# EAGLE board Mega 2560 Z21 (EAGLE 9.6.0)
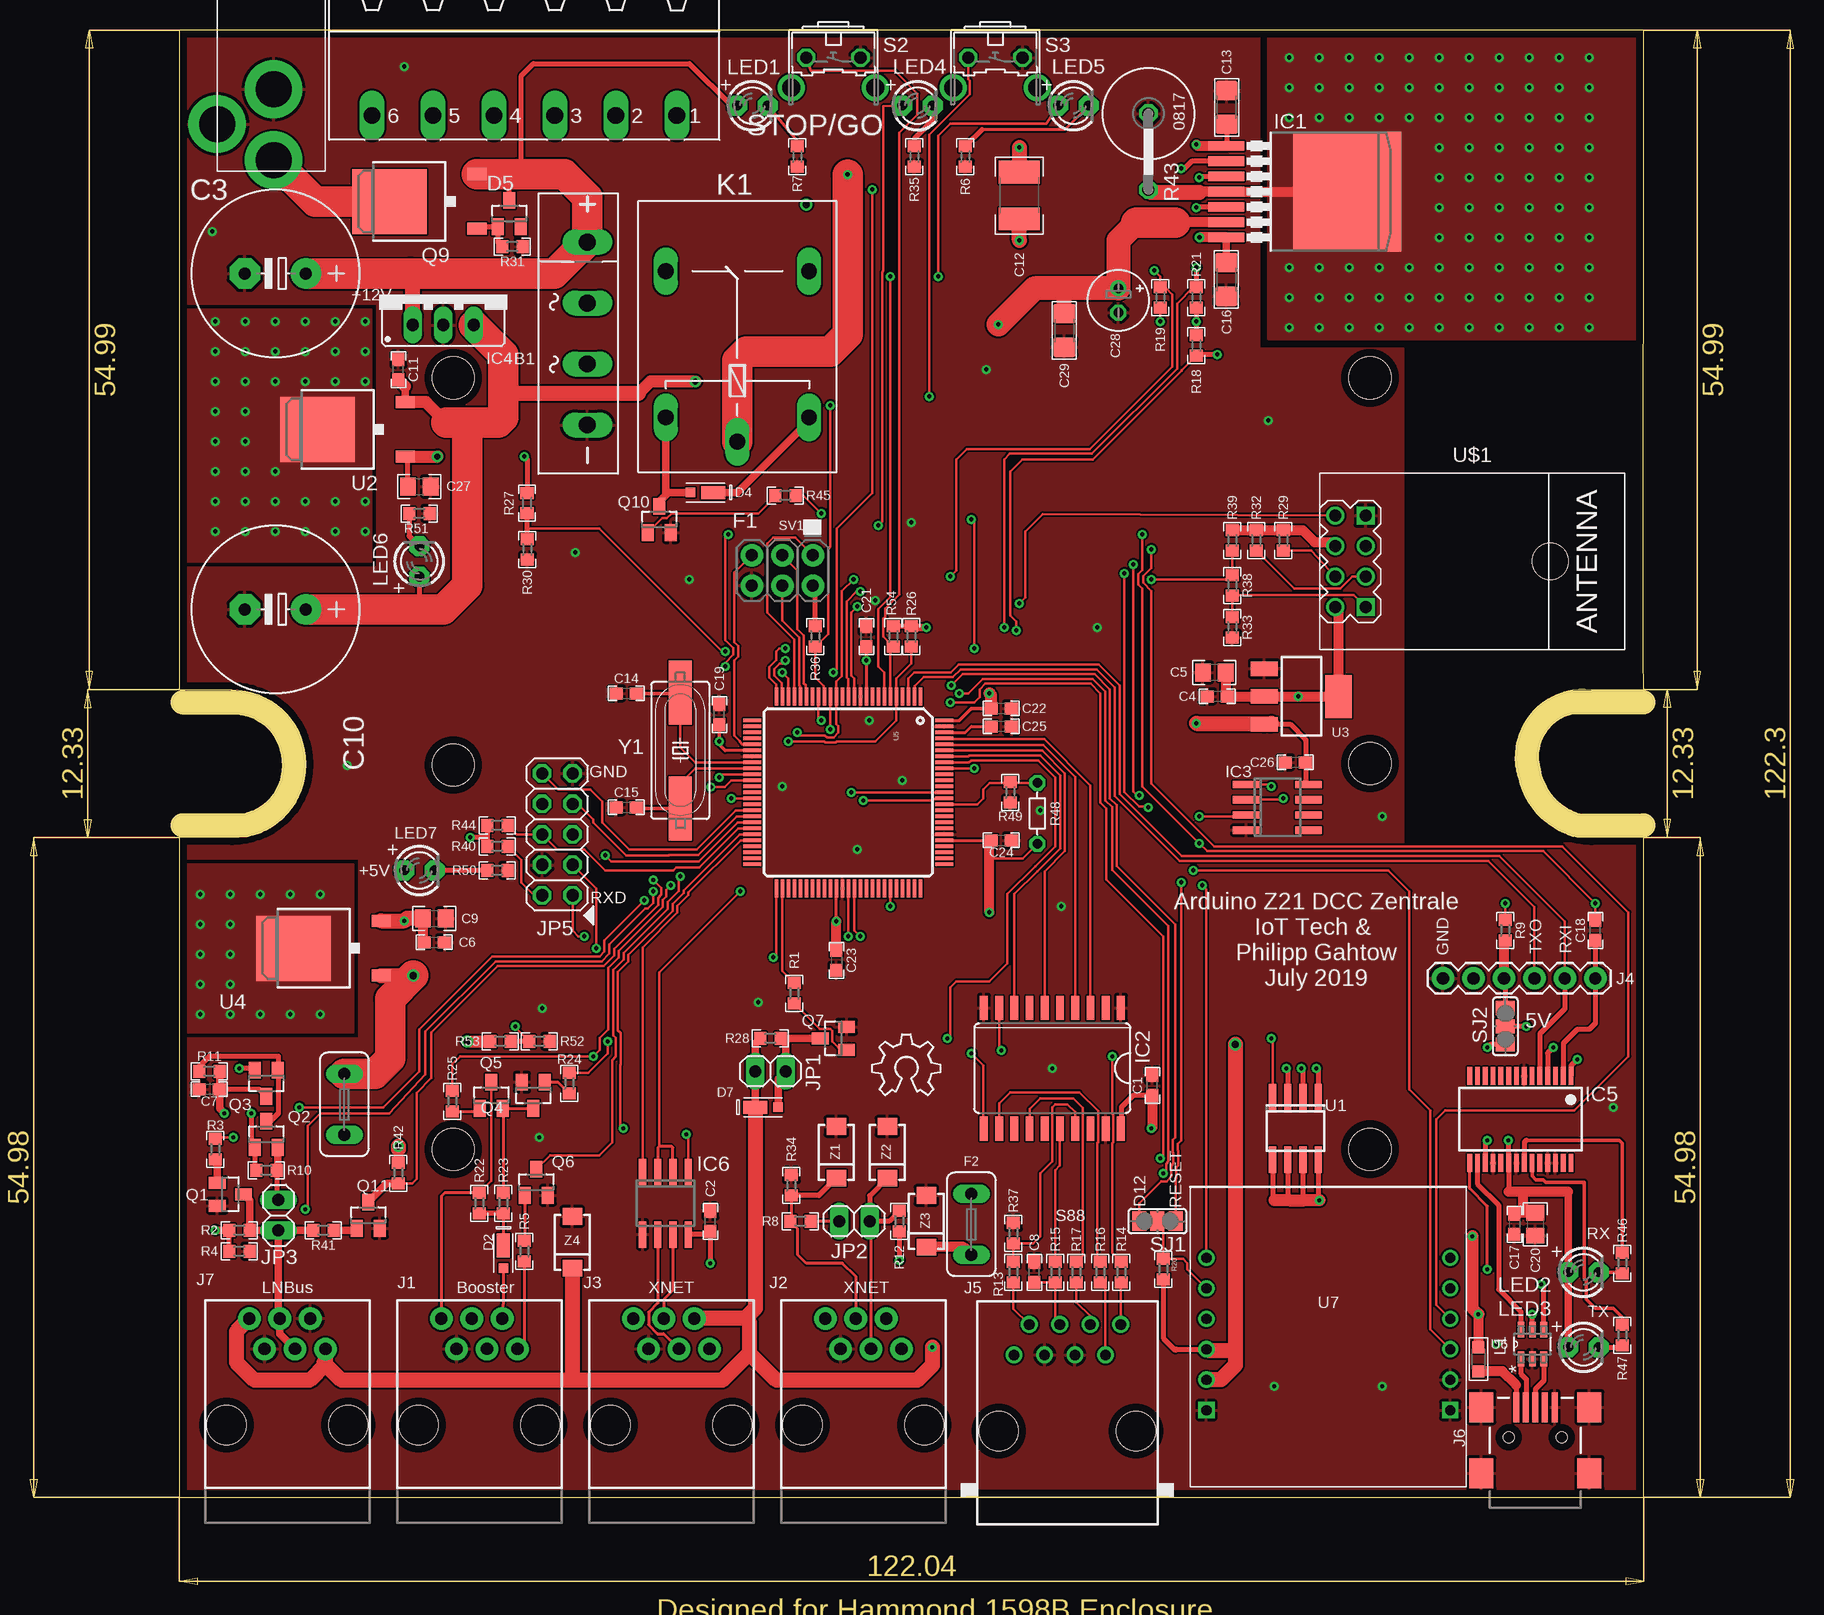
[diagram p1: board, top side]
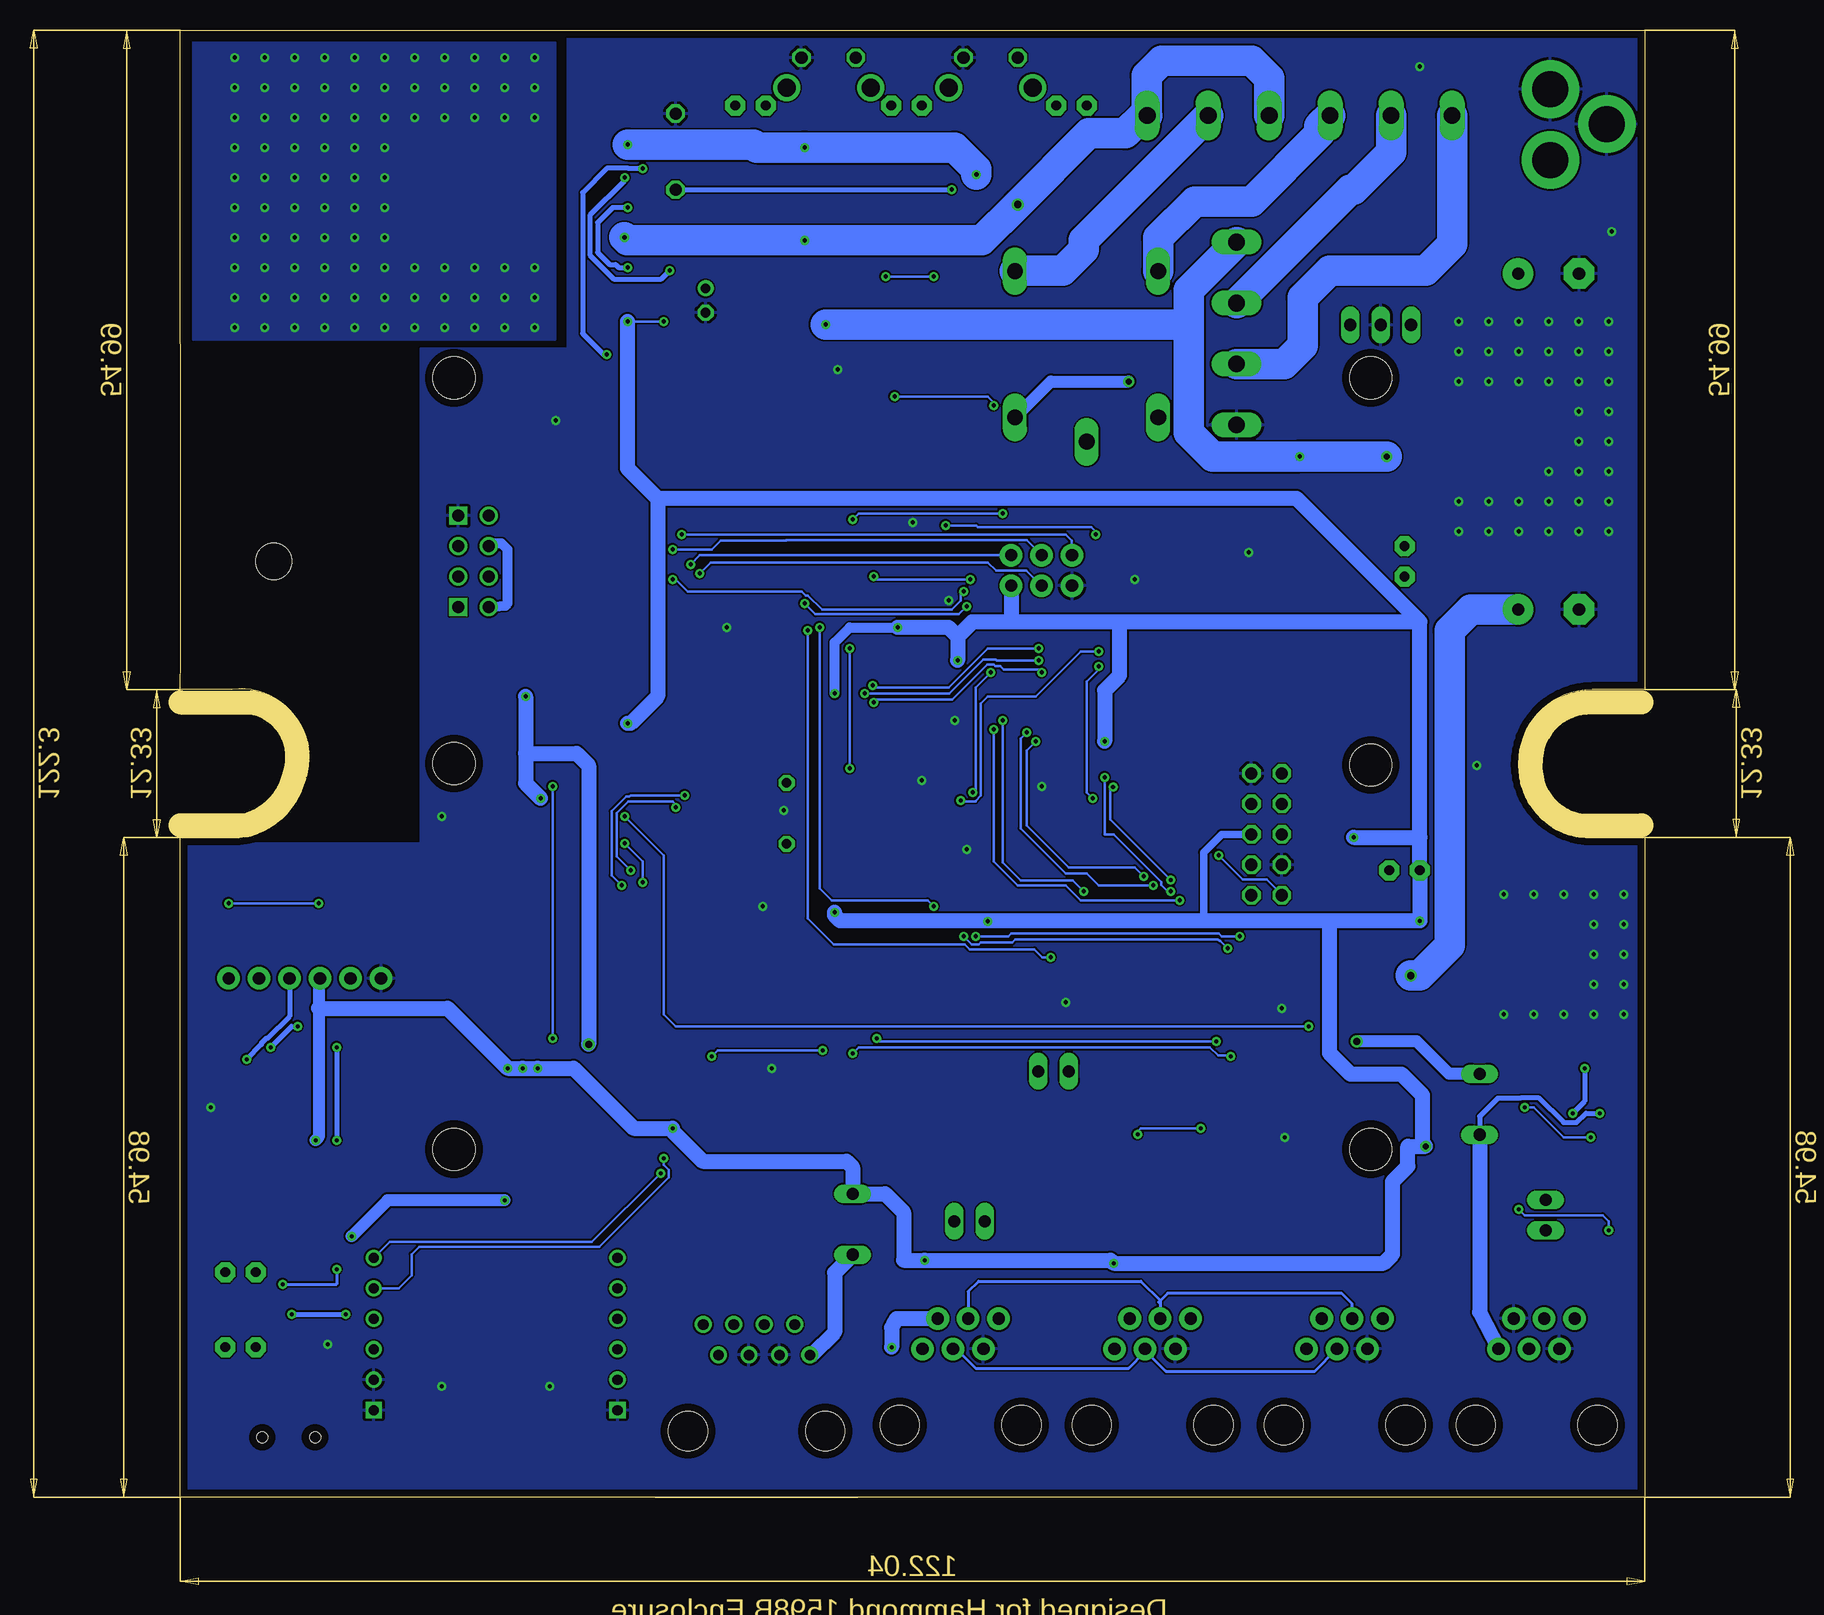
[diagram p2: board, bottom side, seen from below]

Size 122.04 x 122.3 mm. Coordinates in mm from the lower left corner, seen from the top.
Outline: 0,0 122.04,0 122.04,54.98 117.69,54.98 arc-90 111.51,61.15 arc-106 117.69,67.31 122.04,67.31 122,70 122.04,122.3 0,122.3 0,67.31 4.38,67.31 arc-90 10.53,61.15 10.53,61.02 arc-90 4.38,54.98 0,54.98 0,0
Copper layers (1*16): Top 0.035mm / dielectric 1.5mm / Bottom 0.035mm
Design rules "default": minimum track width 6mil, minimum drill 0.35mm, track to track 6mil, track to pad 6mil, pad to pad 6mil, via to via 6mil, smd to smd 6mil, copper to edge 25mil, drill to drill 6mil, minimum pad ring 10mil, minimum via ring 8mil, stop-mask expansion 4mil, vias tented up to drill 0mil, thermal gap 10mil
Net classes: 1 pwr: width 0.2 mm, drill 0.3 mm, clearance 0.205 mm to class 0, clearance 0.205 mm; 2 gnd: width 0.2 mm, drill 0.3 mm, clearance 0.205 mm to class 0, clearance 0.205 mm to class 1, clearance 0.205 mm
Holes 3.5 mm at 22.82,29 22.82,61.02 22.82,93.3 99.22,29 99.22,61.15 99.22,93.3
Holes 3 mm at 114.25,78
Milling: 8 lines

## Footprints (pad centres in the part's own frame; a part is rotated, then mirrored left to right if it is on the bottom)
KBU-6D = drill 1.397 long: + -7.62,0; - 7.62,0; AC1 -2.54,0; AC2 2.54,0
C0603 = smd 1.1 x 1: 1 -0.85,0; 2 0.85,0
E5-13 = drill 1.016 pad 2.54: + -2.54,0 | drill 1.016 pad 2.54 octagon: - 2.54,0
C0805 = smd 1.3 x 1.5: 1 -0.95,0; 2 0.95,0
C1812 = smd 1.9 x 3.4: 1 -1.95,0; 2 1.95,0
C1206 = smd 1.6 x 1.8: 1 -1.4,0; 2 1.4,0
E2-5 = drill 0.813 pad 1.27: + -1.016,0 | drill 0.813 pad 1.27 octagon: - 1.016,0
MICROSMP = smd 0.8 x 0.8: A 0.65,0 | smd 2 x 1.1: C -1.25,0
SOT23 = smd 1 x 1.4: 1 -0.95,-1.1; 2 0.95,-1.1; 3 0,1.1
TE5 = drill 1.016 long: 1 -2.54,0; 2 2.54,0
P-TO263-7-1 = smd 0.8 x 3: 1 -3.81,-9.207; 2 -2.54,-9.207; 3 -1.27,-9.207; 4 0,-9.207; 5 1.27,-9.207; 6 2.54,-9.207; 7 3.81,-9.207 | smd 10 x 9: 8 0,0.895
SO20W = smd 0.66 x 2.032: 1 -5.715,-5.029; 2 -4.445,-5.029; 3 -3.175,-5.029; 4 -1.905,-5.029; 5 -0.635,-5.029; 6 0.635,-5.029; 7 1.905,-5.029; 8 3.175,-5.029; 9 4.445,-5.029; 10 5.715,-5.029; 11 5.715,5.029; 12 4.445,5.029; 13 3.175,5.029; 14 1.905,5.029; 15 0.635,5.029; 16 -0.635,5.029; 17 -1.905,5.029; 18 -3.175,5.029; 19 -4.445,5.029; 20 -5.715,5.029
SO08 = smd 0.6 x 2.2: 1 -1.905,-2.6; 2 -0.635,-2.6; 3 0.635,-2.6; 4 1.905,-2.6; 5 1.905,2.6; 6 0.635,2.6; 7 -0.635,2.6; 8 -1.905,2.6
78XXS = drill 1.016 long: GND 0,-2.54; IN -2.54,-2.54; OUT 2.54,-2.54
SSOP28 = smd 0.4 x 1.5: 1 -4.225,-3.625; 2 -3.575,-3.625; 3 -2.925,-3.625; 4 -2.275,-3.625; 5 -1.625,-3.625; 6 -0.975,-3.625; 7 -0.325,-3.625; 8 0.325,-3.625; 9 0.975,-3.625; 10 1.625,-3.625; 11 2.275,-3.625; 12 2.925,-3.625; 13 3.575,-3.625; 14 4.225,-3.625; 15 4.225,3.625; 16 3.575,3.625; 17 2.925,3.625; 18 2.275,3.625; 19 1.625,3.625; 20 0.975,3.625; 21 0.325,3.625; 22 -0.325,3.625; 23 -0.975,3.625; 24 -1.625,3.625; 25 -2.275,3.625; 26 -2.925,3.625; 27 -3.575,3.625; 28 -4.225,3.625
SOIC8 = smd 0.6 x 2.2: 1 -1.905,-2.6; 2 -0.635,-2.6; 3 0.635,-2.6; 4 1.905,-2.6; 5 1.905,2.6; 6 0.635,2.6; 7 -0.635,2.6; 8 -1.905,2.6
RJ11-6 = drill 1.016 pad 1.88: 1 -3.175,8.89; 2 -1.905,6.35; 3 -0.635,8.89; 4 0.635,6.35; 5 1.905,8.89; 6 3.175,6.35 | hole 3.251: -5.08,0; 5.08,0
1X06 = drill 1.016 pad 1.88: 1 0,0; 2 2.54,0; 3 5.08,0; 4 7.62,0; 5 10.16,0; 6 12.7,0
RJ45-NO-SHIELD = drill 0.9 pad 1.4: 1 -4.445,6.35; 2 -3.175,8.89; 3 -1.905,6.35; 4 -0.635,8.89; 5 0.635,6.35; 6 1.905,8.89; 7 3.175,6.35; 8 4.445,8.89 | hole 3.251: -5.715,0; 5.715,0
USB-MINIB = smd 2.5 x 0.5: D+ 2.5,0; D- 2.5,0.8; GND 2.5,-1.6; ID 2.5,-0.8; VBUS 2.5,1.6 | smd 2.5 x 2: S1 -3,4.5; S2 2.5,4.5; S3 -3,-4.5; S4 2.5,-4.5 | hole 0.9: 0,2.2; 0,-2.2
1X02 = drill 1.016 long: 1 -1.27,0; 2 1.27,0
2X05 = drill 1.016 octagon: 1 -5.08,-1.27; 2 -5.08,1.27; 3 -2.54,-1.27; 4 -2.54,1.27; 5 0,-1.27; 6 0,1.27; 7 2.54,-1.27; 8 2.54,1.27; 9 5.08,-1.27; 10 5.08,1.27
G5LE = drill 1.321 long: 1 -7.493,-5.969; 2 -7.493,5.969; O 4.699,5.969; P -9.525,0; S 4.699,-5.969
L2012C = smd 1 x 1: 1 -1,0; 2 1,0
LED3MM = drill 0.813 pad 1.676 octagon: A -1.27,0; K 1.27,0
TO252 = smd 1 x 1.6: 1 -2.28,-4.8; 2 2.28,-4.8 | smd 5.4 x 6.2: 3 0,2.5
R0603 = smd 1 x 1.1: 1 -0.85,0; 2 0.85,0
P0817V = drill 1.016 octagon: 1 -5.08,0; 2 1.27,0
R-5 = drill 0.813 octagon: 1 -2.54,0; 2 2.54,0
B3F-31XX = drill 1.016 octagon: 1 -2.261,-1.245; 2 2.261,-1.245 | drill 1.499 pad 2.159: 3 -3.505,1.245; 4 3.505,1.245
SJ_2 = smd 1.168 x 1.6: 1 -1.524,0; 2 0,0; 3 1.524,0
2X3-NS = drill 1.016 pad 1.88: 1 -2.54,-1.27; 2 -2.54,1.27; 3 0,-1.27; 4 0,1.27; 5 2.54,-1.27; 6 2.54,1.27
DPAK2 = smd 1 x 1.6: 1 -2.28,-6.07; 3 2.28,-6.07 | smd 5.4 x 6.2: 4 0,1.23
SOT223 = smd 1.219 x 2.235: 1 -2.311,-3.099; 2 0,-3.099; 3 2.311,-3.099 | smd 3.6 x 2.2: 4 0,3.099
TQFP100 = smd 1.5 x 0.3: 1 -8,6; 2 -8,5.5; 3 -8,5; 4 -8,4.5; 5 -8,4; 6 -8,3.5; 7 -8,3; 8 -8,2.5; 9 -8,2; 10 -8,1.5; 11 -8,1; 12 -8,0.5; 13 -8,0; 14 -8,-0.5; 15 -8,-1; 16 -8,-1.5; 17 -8,-2; 18 -8,-2.5; 19 -8,-3; 20 -8,-3.5; 21 -8,-4; 22 -8,-4.5; 23 -8,-5; 24 -8,-5.5; 25 -8,-6; 51 8,-6; 52 8,-5.5; 53 8,-5; 54 8,-4.5; 55 8,-4; 56 8,-3.5; 57 8,-3; 58 8,-2.5; 59 8,-2; 60 8,-1.5; 61 8,-1; 62 8,-0.5; 63 8,0; 64 8,0.5; 65 8,1; 66 8,1.5; 67 8,2; 68 8,2.5; 69 8,3; 70 8,3.5; 71 8,4; 72 8,4.5; 73 8,5; 74 8,5.5; 75 8,6 | smd 0.3 x 1.5: 26 -6,-8; 27 -5.5,-8; 28 -5,-8; 29 -4.5,-8; 30 -4,-8; 31 -3.5,-8; 32 -3,-8; 33 -2.5,-8; 34 -2,-8; 35 -1.5,-8; 36 -1,-8; 37 -0.5,-8; 38 0,-8; 39 0.5,-8; 40 1,-8; 41 1.5,-8; 42 2,-8; 43 2.5,-8; 44 3,-8; 45 3.5,-8; 46 4,-8; 47 4.5,-8; 48 5,-8; 49 5.5,-8; 50 6,-8; 76 6,8; 77 5.5,8; 78 5,8; 79 4.5,8; 80 4,8; 81 3.5,8; 82 3,8; 83 2.5,8; 84 2,8; 85 1.5,8; 86 1,8; 87 0.5,8; 88 0,8; 89 -0.5,8; 90 -1,8; 91 -1.5,8; 92 -2,8; 93 -2.5,8; 94 -3,8; 95 -3.5,8; 96 -4,8; 97 -4.5,8; 98 -5,8; 99 -5.5,8; 100 -6,8
SOT95P280X145-6N = smd 1.27 x 0.559: 1 -1.219,0.95; 2 -1.219,0; 3 -1.219,-0.95; 4 1.219,-0.95; 5 1.219,0; 6 1.219,0.95
WIZ850IO = drill 0.85: 3V31 10.16,-2.54; 3V32 10.16,-5.08; !RST 10.16,-10.16; !SCN -10.16,-10.16; GND2 -10.16,-2.54; INTN -10.16,-12.7; MISO 10.16,-12.7; MOSI -10.16,-5.08; NC 10.16,-7.62; SCLK -10.16,-7.62 | drill 0.85 square: GND1 -10.16,0; GND3 10.16,0
WIRELESS-WIFI-ESP-01 = drill 1 square: A1 -8.89,3.81; D1 -8.89,-3.81 | drill 1: A2 -11.43,3.81; B1 -8.89,1.27; B2 -11.43,1.27; C1 -8.89,-1.27; C2 -11.43,-1.27; D2 -11.43,-3.81
PJ-102A = drill 3 pad 4.8: RING 0.1,-3.39; RING_SW -4.6,-6.29; TIP 0.1,-9.29
MSTBA6 = drill 1.397 long: 1 -12.7,5.08; 2 -7.62,5.08; 3 -2.54,5.08; 4 2.54,5.08; 5 7.62,5.08; 6 12.7,5.08
HC49UP = smd 5.334 x 1.93: 1 -4.826,0; 2 4.826,0
SMA = smd 1.4 x 1.64: A -2.15,0; C 2.15,0

## Placement (x,y rotation side)
B1  BRIDGE_RECTIFIER_6AMP  [KBU-6D]  34,97 270 top
C1  100nf  [C0603]  81.09,34.32 90 top
C2  100nf  [C0603]  44.25,23 90 top
C3  1000uf  [E5-13]  8,102 180 top
C4  100nf  [C0603]  86.5,66.75 180 top
C5  10uf  [C0805]  86.25,68.75 180 top
C6  100nf  [C0603]  21.25,46.25 0 top
C7  100nf  [C0603]  2.5,34 180 top
C8  10nf  [C0603]  71.25,18.75 90 top
C9  10uf  [C0805]  21.25,48.25 0 top
C10  470uf  [E5-13]  8,74 180 top
C11  100nf  [C0603]  18.25,94 90 top
C12  [C1812]  70,108.5 90 top
C13  100nf  [C1206]  87.29,115.85 90 top
C14  18pf  [C0603]  37.25,67 0 top
C15  18pf  [C0603]  37.25,57.5 0 top
C16  100nf  [C1206]  87.25,101.5 270 top
C17  100nf  [C0603]  111.25,22.75 270 top
C18  100nf  [C0603]  118,47.25 90 top
C19  100nf  [C0603]  45,65.25 90 top
C20  10uF  [C0805]  113,22.75 270 top
C21  100nf  [C0603]  57.25,71.75 90 top
C22  100nf  [C0603]  68.5,65.75 0 top
C23  100nf  [C0603]  54.75,44.75 270 top
C24  100nf  [C0603]  68.5,54.75 0 top
C25  100nf  [C0603]  68.5,64.25 180 top
C26  100nf  [C0603]  93,61.25 180 top
C27  100nf  [C0805]  20,84.25 0 top
C28  100uf  [E2-5]  78.25,99.75 270 top
C29  100nf  [C1206]  73.75,97.25 270 top
D2  MICROSMD-SCHOTTKY-DIODE  [MICROSMP]  27,19.75 270 top
D4  MICROSMD-SCHOTTKY-DIODE  [MICROSMP]  43.25,83.75 180 top
D5  [SOT23]  27.5,107 0 top
D7  MICROSMD-SCHOTTKY-DIODE  [MICROSMP]  49.25,32.5 0 top
F1  [TE5]  13.75,32.75 90 top
F2  [TE5]  66,22.75 90 top
IC1  TLE5205-2G  [P-TO263-7-1]  96.43,108.82 270 top
IC2  74AC244DW  [SO20W]  72.75,35.75 180 top
IC3  LM358D  [SO08]  91.5,57.5 270 top
IC4  [78XXS]  22,100.25 0 top
IC5  FT232RL  [SSOP28]  111.75,31.5 180 top
IC6  LTC485S  [SOIC8]  40.5,24.5 180 top
J1  RJ11  [RJ11-6]  25,6 0 top
J2  RJ11  [RJ11-6]  57,6 0 top
J3  RJ11  [RJ11-6]  41,6 0 top
J4  [1X06]  118,43.25 180 top
J5  RJ45-6L-B  [RJ45-NO-SHIELD]  74,5.5 0 top
J6  USB_MINI-B_SMT  [USB-MINIB]  113,5 90 top
J7  RJ11  [RJ11-6]  9,6 0 top
JP1  [1X02]  49.25,35.5 0 top
JP2  [1X02]  56.25,23 180 top
JP3  [1X02]  8.25,23.5 90 top
JP5  [2X05]  31.5,55.25 90 top
K1  G5LE  [G5LE]  46.5,97.5 90 top
L1  [L2012C]  108.25,11.5 270 top
LED1  Yellow  [LED3MM]  47.75,116 0 top
LED2  Blue  [LED3MM]  117,18.75 0 top
LED3  Yellow  [LED3MM]  117,12.5 0 top
LED4  RED  [LED3MM]  61.5,116 0 top
LED5  Yellow  [LED3MM]  74.5,116 0 top
LED6  Green  [LED3MM]  20,78 90 top
LED7  Green  [LED3MM]  20,52.25 0 top
LOGO1  OSHW_LOGO_6MILX0200-NT  [OSHW_6X200_NOTEXT]  57.75,33.5 0 top
Q1  BC847  [SOT23]  4.25,25.25 270 top
Q2  BC847  [SOT23]  7.25,30.25 0 top
Q3  BC847  [SOT23]  7.25,34.5 180 top
Q4  BC847  [SOT23]  29.5,33.5 180 top
Q5  BC847  [SOT23]  26,33.5 0 top
Q6  BC847  [SOT23]  29.75,26.25 0 top
Q7  BC847  [SOT23]  54.5,38.25 90 top
Q9  FDD4141TO252  [TO252]  20,108 90 top
Q10  BC847  [SOT23]  40,81.5 0 top
Q11  BC847  [SOT23]  15.75,23.5 0 top
R1  4.7k  [R0603]  51.25,42 90 top
R2  100k  [R0603]  5,22.25 180 top
R3  4.7k  [R0603]  3,29 90 top
R4  47k  [R0603]  5,20.5 0 top
R5  4.7k  [R0603]  28.75,20.5 90 top
R6  470  [R0603]  65.5,111.75 90 top
R7  4k7  [R0603]  51.5,111.75 90 top
R8  120R  [R0603]  51.75,23 0 top
R9  10K  [R0603]  110.5,47.25 270 top
R10  47  [R0603]  7.25,27.25 180 top
R11  10k  [R0603]  2.5,35.5 0 top
R12  47K  [R0603]  60,23 270 top
R13  47  [R0603]  69.5,18.75 270 top
R14  47  [R0603]  78.5,18.75 90 top
R15  47  [R0603]  73,18.75 90 top
R16  47  [R0603]  76.75,18.75 90 top
R17  47  [R0603]  74.75,18.75 90 top
R18  10k  [R0603]  84.75,96 270 top
R19  10k  [R0603]  81.75,100 90 top
R20  10K  [R0603]  82,19 270 top
R21  10k  [R0603]  84.75,100 90 top
R22  2k2  [R0603]  25,24.5 90 top
R23  10k  [R0603]  27,24.5 90 top
R24  4.7k  [R0603]  32.5,34.5 90 top
R25  4.7k  [R0603]  22.75,33 90 top
R26  10K  [R0603]  61,71.75 90 top
R27  22k  [R0603]  28.97,82.86 90 top
R28  10k  [R0603]  49.25,38.25 0 top
R29  10k  [R0603]  92,79.75 270 top
R30  1k  [R0603]  29,79 90 top
R31  100k  [R0603]  27.75,104.25 0 top
R32  10k  [R0603]  89.75,79.75 270 top
R33  2k2  [R0603]  87.75,72.5 270 top
R34  47K  [R0603]  51,26 270 top
R35  470  [R0603]  61.25,111.75 90 top
R36  10K  [R0603]  53,71.75 90 top
R37  10k  [R0603]  69.5,22 90 top
R38  1k  [R0603]  87.75,76 270 top
R39  10k  [R0603]  87.75,79.75 270 top
R40  2k2  [R0603]  26.5,54.25 180 top
R41  10k  [R0603]  12,22.25 180 top
R42  470  [R0603]  18.25,27 90 top
R43  0R15-3W  [P0817V]  80.75,110.25 270 top
R44  2k2  [R0603]  26.5,56 180 top
R45  4.7k  [R0603]  50.5,83.5 0 top
R46  1k  [R0603]  120.25,19.5 270 top
R47  1k  [R0603]  120.25,13.5 270 top
R48  THERMISTOR-5  [R-5]  71.5,57 90 top
R49  4.7k  [R0603]  69.25,58.75 90 top
R50  470  [R0603]  26.5,52.25 180 top
R51  470  [R0603]  20,82 180 top
R52  10k  [R0603]  30,38 180 top
R53  15k  [R0603]  26.75,38 180 top
R54  10K  [R0603]  59.5,71.75 90 top
S2  [B3F-31XX]  54.5,118.75 180 top
S3  [B3F-31XX]  68,118.75 180 top
SJ1  [SJ_2]  81.5,23 180 top
SJ2  [SJ_2]  110.5,39.25 90 top
SV1  AVR_SPI_PROG_3X2NS  [2X3-NS]  50.25,77.25 180 top
U1  PFET_S08  [SO08]  93,30.75 180 top
U2  DPAK2-REG  [DPAK2]  12.75,89 90 top
U3  3V3  [SOT223]  93.5,66.75 270 top
U4  DPAK2-REG  [DPAK2]  10.75,45.75 90 top
U5  ATMEGA2560AU  [TQFP100]  55.75,58.75 270 top
U6  [SOT95P280X145-6N]  112.75,12.75 90 top
U7  WIZNET-8X0IO  [WIZ850IO]  95.75,7.25 180 top
U$1  WIRELESS-WIFI-ESP-01  [WIRELESS-WIFI-ESP-01]  107.75,78 0 top
U$2  2.1MMJACKTHM  [PJ-102A]  7.75,120.75 0 top
X9  MSTBA6  [MSTBA6]  28.75,120.25 180 top
Y1  HC49UP  [HC49UP]  41.75,62.25 90 top
Z1  TRANSZORB-SMA  [SMA]  54.75,28.75 270 top
Z2  TRANSZORB-SMA  [SMA]  59,28.75 270 top
Z3  TRANSZORB-SMA  [SMA]  62.25,23 270 top
Z4  TRANSZORB-SMA  [SMA]  32.75,21.25 270 top

## Tracks (layer width: path | path; a pad name or v marks a point on that pad's centre or on a via)
!INT  (via drill 0.35)
  Top 0.2: U5.24 50.2,66.8 50.2,67.84 49.58,68.47 49.58,69.03 50.05,69.5 50.25,69.5 v50.5,69.75 | v65,67 65.75,67 66.96,68.21 76.11,68.21 77.15,67.17 77.15,58.09 77.72,57.51 77.72,52.27 82.4,47.6 82.4,28.55 82.42,28.53 82.42,27.97 82.25,27.8 82.25,27.25 v82,27
  Bottom 0.2: v50.5,69.75 53.98,69.75 54.05,69.83 55.11,69.83 57.94,67 64.61,67 v65,67 | v82,27 87.72,21.27 104.58,21.27 U7.INTN
!RST
  Top 0.2: SJ1.2 82,22.5 R20.1 83.65,19.85 84,19.5 84,19 U7.!RST
+3V3  (via drill 0.35, 0.6)
  Top 0.2: IC3.2 91.89,58.13 v92,58.25
  Top 0.406: R20.2 82,13.25 83,12.25 83.08,12.33 U7.3V32
  Top 0.813: R39.1 R32.1 R29.1 93.62,80.6 94.61,79.61 96.15,79.61 U$1.B2 | C5.1 87.2,66.9 C4.1 U3.2 v93.25,66.75 U3.4 96.6,74.08 U$1.D2
  Top 1.27: v88,37.75 88,12.25 | 88,12.25 88,11 86.79,9.79 U7.3V31 | U7.3V32 85.67,12.25 88,12.25
  Bottom 0.813: U$1.D2 94.93,74.32 94.75,74.5 94.75,79 95.25,79.5 96.26,79.5 U$1.B2
  Bottom 1.27: v93.25,66.75 93.25,62 | 93.25,62 93.25,59.5 v92,58.25 | 93.25,62 89,62 88,61 v88,37.75
+5V  (via drill 0.35, 0.5)
  Top 0.2: 67.5,53.25 70.29,53.25 R48.1 | R19.1 v81.75,98
  Top 0.254: v57.25,69.75 U5.10 | U5.80 C24.1 | v54.75,48 U5.61 | U5.31 45.5,62.25 | U5.100 65,64.75
  Top 0.305: C21.1 v57.25,69.75 | C22.1 66,65.75 65,64.75 | 45.5,62.25 45,62.75 v45,63 C19.1
  Top 0.406: R21.1 v84.75,98 R18.1 | IC2.20 78.5,30.76 78.5,32.5 79.5,33.5 79.53,33.47 C1.1 | SJ2.3 110.5,43.13 J4.4 | v110.75,29.75 110.75,27.9 IC5.20 110.78,25.45 | IC6.8 44,21.9 C2.1 v44.25,19.5 | R44.2 25.65,55 | 25.65,55 R40.2 | 25.65,55 v24.25,55 | R12.2 v60,19.75 | U1.3 92.36,35.63 v92.25,35.75 | U1.2 93.64,35.62 v93.5,35.75 | U1.1 94.91,35.59 v94.75,35.75 | U3.3 92.56,64.44 93.88,63.12 93.85,63.1 C26.1 93.85,59.66 IC3.8 | R54.2 R26.2 | R36.2 53,75.77 SV1.2
  Top 0.61: v62.25,72.5 61.1,72.5 R26.2 | LED3.A LED2.A 115.73,25.45
  Top 0.813: 18.25,29 R42.2 | v81,30.75 81.09,30.84 C1.1 | J4.4 110.38,46.28 R9.2 | v67.5,48.75 67.5,53.25 67.5,54.6 C24.1 | C23.1 v54.75,48 | C9.1 20.3,46.35 C6.1 | 115.73,25.45 112,25.45 | 112,25.45 110.78,25.45 | C20.1 112,23.7 | 112,23.7 111.35,23.7 C17.1 | 112,23.7 112,25.45
  Top 1.016: C22.1 67.65,66.85 v67.5,67
  Top 1.27: U4.3 v18.75,48.03 18.97,48.25 C9.1 | v18.25,29.25 18.25,29 | v84.75,64.5 91,64.5 90.94,64.44 U3.3
  Bottom 0.2: v81.75,98 v84.75,98
  Bottom 0.61: JP5.5 35.25,55.25 36.75,53.75 36.75,48.03
  Bottom 0.813: v67.5,67 67.5,71.25 66.25,72.5 v62.25,72.5 | 54.75,48.03 v54.75,48
  Bottom 1.016: J4.4 110.5,43.13 110.5,40.75 110.5,30 v110.75,29.75
  Bottom 1.27: 18.75,73 18.75,72.96 43.75,72.96 | 18.75,73 29,83.25 82.25,83.25 | 82.25,83.25 84.75,85.75 v84.75,98 | 82.25,83.25 82.25,66.75 84.5,64.5 v84.75,64.5 | SV1.2 52.79,72.96 | 57.25,71.75 v57.25,69.75 | 57.25,71.75 58,72.5 v62.25,72.5 | v67.5,48.75 67.5,48.5 67.03,48.03 54.75,48.03 36.75,48.03 26.25,48.03 | 26.25,48.03 v18.75,48.03 18.73,48.05 LED7.A 18.73,55 | v45,63 45,67.25 43.75,68.5 43.75,72.96 | 43.75,72.96 52.79,72.96 | 52.79,72.96 56.04,72.96 57.25,71.75 | 18.73,55 18.73,72.98 18.75,73 | v24.25,55 18.73,55 | 26.25,48.03 26.25,37 24.5,35.25 20.25,35.25 18.5,33.5 18.5,29.5 v18.25,29.25 19.73,29.25 19.73,27.58 21,26.31 21,20.25 21.75,19.5 v44.25,19.5 44.5,19.75 v60,19.75 61.75,19.75 61.75,23.75 63.29,25.29 F2.2 66,27.5 66.5,28 78.5,28 81,30.5 v81,30.75 84.25,30.75 89.25,35.75 v92.25,35.75 v93.5,35.75 v94.75,35.75 99.75,40.75 110.5,40.75
+12V  (via drill 0.5, 0.6)
  Top 0.406: LED6.A 20,74
  Top 0.61: 18.82,92.58 U2.3 | D4.C 46.5,83.75 52.47,89.72 K1.1
  Top 1.016: 22.25,89.58 20.55,91.28 U2.3 | C11.1 18.82,92.58 | v43,93 39.25,93 38.25,92 | v24,38 R53.2
  Top 1.27: U4.1 v19.5,43.47 | 27,92.25 27.25,92 38.25,92
  Top 2.54: 24,89.58 22.25,89.58 | C10.+ 20,74 22,74 24,76 24,89.58 | v19.5,43.47 17.57,41.54 17.57,36.57 16.29,35.29 F1.2 | IC4.OUT 27,95.25 27,92.25 27,90 26.58,89.58 24,89.58
  Bottom 1.016: K1.1 49.48,93 v43,93 | F1.2 16.29,35.29 19,38 v24,38
  Bottom 1.27: 19.5,43.5 v19.5,43.47
  Bottom 2.54: C10.+ 14.5,74 16.25,72.25 16.25,46 18.75,43.5 19.5,43.5
+18V  (via drill 0.35, 0.5)
  Top 0.406: C27.1 19.05,86.49 U2.1 | v28.75,86.75 28.97,86.53 R27.2 | LED1.A 45.98,116.02 42.5,119.5 29.5,119.5 28.5,118.5 28.5,110.4 28.36,110.26 28.27,110.26 28.25,110.28 28.02,110.28 27.5,109.76 D5.3
  Top 0.813: IC1.6 83.03,106.28 83,106.25
  Top 1.016: U2.1 21.47,86.72 v21.5,86.75
  Top 1.27: C29.1 73.75,100.77 | IC4.IN 19.46,101.79 19.25,102
  Top 2: 79.75,106.25 78.25,104.75 C28.+ 73.75,100.77 71.27,100.77 v68.25,97.75
  Top 2.54: 83,106.25 79.75,106.25 | C3.+ 19.25,102 31.25,102 33.37,104.12 33.5,104.12 B1.+ 34,108.37 32.09,110.28 28.25,110.28 Q9.2
  Bottom 2.54: v21.5,86.75 v28.75,86.75 36,86.75 38,88.75 38,97.75 | 38,97.75 38,100.62 B1.+ | 38,97.75 v68.25,97.75
AV  (via drill 0.35)
  Top 0.2: v45.5,70.5 45.25,70.5 35,80.75 29,80.75 | v57,58.08 62.75,58.08 62.88,58.2 63.7,58.2 U5.87
  Top 0.406: R27.1 29,81.98 29,80.75 R30.2
  Bottom 0.2: v45.5,70.5 47,70.5 50.75,66.75 54.75,66.75 55.33,66.17 55.33,58.47 55.75,58.05 55.75,58 56.92,58 v57,58.08
CLOCK
  Top 0.2: J5.4 73.36,14.63 73,15 73,17.75 | R15.1 73,17.75 | C8.1 72.85,17.9 73,17.75
CS  (via drill 0.35)
  Top 0.2: v50.25,68.75 50.75,68.25 U5.23 | v64.25,66.25 66.25,66.25 66.69,66.69 66.69,67.33 67.17,67.81 75.94,67.81 76.75,67 76.75,57.92 77.25,57.42 77.25,51.5 82,46.75 82,28.5 v81.75,28.25
  Bottom 0.2: v50.25,68.75 50.5,69 53.41,69 53.7,69.3 54.09,69.3 54.22,69.42 54.78,69.42 57.7,66.5 64,66.5 v64.25,66.25 | v81.75,28.25 81.75,27.7 81.33,27.28 81.33,26.68 87.12,20.88 102.12,20.88 102.75,20.25 102.75,18.5 103.84,17.41 U7.!SCN
D12  (via drill 0.35)
  Top 0.2: U5.25 49.75,67.73 49.17,68.31 49.17,69.19 49.75,69.77 49.75,70.5 50,70.75 v50.5,70.75 | SJ1.3 80,23.02 80,24.5 81.83,26.32 82.28,26.32 82.67,26.72 82.67,27.28 82.65,27.3 82.65,27.63 82.83,27.8 82.83,28.7 82.8,28.72 82.8,29.8 83,30 83,47.75 78.12,52.62 78.12,57.68 77.55,58.25 77.55,67.33 76.27,68.61 65.26,68.61 v64.33,67.67
  Bottom 0.2: v50.5,70.75 54.75,70.75 58,67.5 64.16,67.5 v64.33,67.67
DATA
  Top 0.2: J5.2 69.5,15.71 R13.2
DCC  (via drill 0.35)
  Top 0.2: v64.25,76.75 64.75,77.25 64.75,86.5 65.62,87.37 75.87,87.37 82.75,94.25 82.75,100.25 82.15,100.85 R19.2 81.75,101.75 v81.25,102.25 | IC2.11 67,30.76 67,36 v66,37 | v51.5,63.75 51.75,63.5 53.8,63.5 53.97,63.33 54.53,63.33 54.92,63.72 54.92,64.28 54.75,64.45 U5.15 54.75,68 55.2,68.45 55.2,75.52 v56.18,76.5 | R25.2 22.75,36.1 23.4,36.75 v34.5,36.75 35.02,37.27 35.02,38.28 35.75,39.01 35.75,44.1 36.62,44.97 36.62,45.54 40.3,49.21 40.3,49.78 40.58,50.05 40.58,50.62 v40.95,51
  Top 0.406: IC1.3 85.09,110.09 v85,110
  Bottom 0.2: v56.18,76.5 64,76.5 v64.25,76.75 | v34.5,36.75 34.58,36.83 35.55,36.83 36.22,37.5 65.5,37.5 v66,37 | v51.5,63.75 52,63.25 52,55.75 48.25,52 46.5,52 45.5,51 v40.95,51
  Bottom 0.406: v85,110 85,109.75 87.86,106.89 87.86,103.5 85.86,101.5 82,101.5 v81.25,102.25
DCC_STATUS  (via drill 0.35)
  Top 0.2: U5.7 58.75,68.75 58.25,69.25 58.25,74.05 59.25,75.05 v59.25,101.75 | LED5.A 72.23,114.5 64.25,114.5 63.25,113.5 v63.25,101.75
  Bottom 0.2: v63.25,101.75 v59.25,101.75
DTR
  Top 0.406: C18.1 J4.1 118,39.5 117.5,39 116.5,39 115.33,37.83 IC5.2
G1  (via drill 0.35)
  Top 0.2: v54.5,68.75 54.8,69.05 54.8,80.73 57.75,83.68 v57.75,109 | U5.88 v56,58.75
  Top 0.813: IC1.8 IC1.4 85.07,108.82 85,108.75
  Top 1.27: 85,108.75 80.98,108.75 R43.2
  Bottom 0.2: v54.5,68.75 55.75,67.5 55.75,59 v56,58.75
  Bottom 0.406: R43.2 57.77,108.98 v57.75,109
  other vias: 92.5,102.5 92.5,100 92.5,97.5 95,97.5 95,100 95,102.5 97.5,102.5 97.5,100 97.5,97.5 100,97.5 102.5,97.5 105,97.5 107.5,97.5 110,97.5 112.5,97.5 115,97.5 117.5,97.5 117.5,100 117.5,102.5 117.5,105 117.5,107.5 117.5,110 117.5,112.5 117.5,115 117.5,117.5 117.5,120 115,120 112.5,120 110,120 107.5,120 105,120 102.5,120 100,120 97.5,120 95,120 92.5,120 92.5,117.5 92.5,115 95,115 95,117.5 97.5,117.5 97.5,115 100,115 100,117.5 102.5,117.5 105,117.5 107.5,117.5 110,117.5 112.5,117.5 115,117.5 115,115 115,112.5 115,110 115,107.5 115,105 115,102.5 115,100 112.5,100 110,100 107.5,100 105,100 102.5,100 100,100 100,102.5 102.5,102.5 105,102.5 107.5,102.5 110,102.5 112.5,102.5 112.5,105 110,105 107.5,105 105,105 105,107.5 107.5,107.5 110,107.5 112.5,107.5 112.5,110 110,110 107.5,110 105,110 105,112.5 107.5,112.5 110,112.5 112.5,112.5 112.5,115 110,115 107.5,115 105,115 102.5,115
  pour Top (no thermals): 90.75,121.75 121.5,121.75 121.5,96.5 90.75,96.5
  pour Bottom: 90.75,121.25 121,121.25 121,96.5 90.75,96.5
GND  (via drill 0.35)
  other vias: 1.75,40.25 9.25,40.25 4.25,40.25 6.75,40.25 11.75,40.25 1.75,42.75 1.75,45.25 1.75,47.75 1.75,50.25 4.25,50.25 6.75,50.25 9.25,50.25 11.75,50.25 4.25,47.75 4.25,45.25 4.25,42.75 15.5,83 13,83 10.5,83 8,83 8,80.5 5.5,80.5 3,80.5 3,83 5.5,83 5.5,85.5 8,85.5 3,85.5 3,88 5.5,88 5.5,90.5 3,90.5 3,93 5.5,93 8,93 10.5,93 13,93 15.5,93 15.5,95.5 15.5,98 13,98 10.5,98 8,98 5.5,98 3,98 3,95.5 5.5,95.5 8,95.5 10.5,95.5 13,95.5 10.5,80.5 13,80.5 15.5,80.5 30,30 30.25,40.75 50.25,59.25 60.25,59.75 57.5,64.75 56.5,54 61,81.25 71.75,57.25 73.5,49.25 91.25,9.25 119.5,32.5 100.25,56.75 76.5,72.5 33,78.75 48.25,41.25 14,61 90.75,89.75 67.25,94 42.5,76.5 2.75,105.5 100.25,9.25 109.75,12.75 58,74.75 18.75,119.25 72.75,35.75
  pour Top (no thermals): 16,78 16,99 0.75,99 0.5,99 0.5,78
  pour Top (no thermals): 14.5,38.75 14.5,52.75 0,52.75 0,38.75
  pour Bottom: 0,122 89.75,122 89.75,95.75 102,95.75 102,54.5 121.95,54.5 121.75,0 0,0
  pour Top: 0,122.25 90,122.25 90,95.75 102,95.75 102,54.5 122.25,54.5 122.25,0 0,0 0,38.25 15,38.25 15,53.25 0,53.25 0,77.5 16.5,77.5 16.5,99.5 0,99.5
GO/STOP  (via drill 0.35)
  Top 0.2: R24.2 34.05,35.35 35.7,36.99 v35.7,38 | U5.93 65.8,61.25 65.97,61.42 71.58,61.42 73,60 73,54.25 71.33,52.58 71.31,52.58 69,50.27 69,44.5 67.5,43 64.75,43 64.25,42.5 64.25,38.5 v64,38.25
  Bottom 0.2: v64,38.25 63.75,38 v35.7,38
GO/STOP2  (via drill 0.35)
  Top 0.2: v59.25,49.25 U5.70 | v68.75,72.5 68.75,86.5 69.22,86.97 76.03,86.97 83.15,94.08 83.15,99.5 84.5,100.85 R21.2
  Top 0.406: IC1.5 84.8,107.55 v84.75,107.5 | v84.75,102.5 R21.2
  Bottom 0.2: v68.75,72.5 68.75,50.75 67.75,49.75 59.75,49.75 v59.25,49.25
  Bottom 0.406: v84.75,107.5 86,107.5 87.25,106.25 87.25,103.75 86.25,102.75 85.75,102.75 85.5,102.5 v84.75,102.5
INT
  Top 0.2: U5.41 46.38,57.25 43.13,54 37.5,54 35.25,56.25 35.25,58 34.25,59 31.56,59 JP5.10
KEY
  Top 0.2: JP5.7 33.21,57.79 34.5,56.5 34.5,56.25 37.25,53.5 40.78,53.5 40.81,53.52 43.22,53.52 46.45,56.75 U5.42
KS
  Top 0.2: R1.2 50.25,43.85 U5.52
LN_IN  (via drill 0.35)
  Top 0.2: U5.35 45.25,60.25 v45,60 | v39.5,50.5 39.5,49.55 39.03,49.08 38.83,49.08 35.83,46.08 35.83,45.3 35.2,44.67 26.36,44.67 20.5,38.82 20.5,35.22 17.5,32 11.75,32 10.7,30.95 10.7,24.2 v10.5,24
  Top 0.406: R4.1 R2.2
  Top 0.61: R2.2 v3,22.25
  Bottom 0.2: v3,22.25 3,23 3.5,23.5 10,23.5 v10.5,24 | v45,60 45,55.25 44.24,55.25 40.27,51.28 40.27,51.02 39.75,50.5 v39.5,50.5
LN_OUT  (via drill 0.35)
  Top 0.2: U5.16 v54.25,64 | R3.2 3.15,30 v4.5,30 | v10,32.5 17,32.5 20,35.5 20,39 26.07,45.08 35.03,45.08 35.42,45.47 35.42,46.42 v38.75,49.75
  Bottom 0.2: v54.25,64 54.25,53 52.25,51 48.25,51 47,49.75 v38.75,49.75 | v4.5,30 6.75,30 9.25,32.5 v10,32.5
LN_RECEIVE  (via drill 0.35)
  Top 0.2: U5.36 46,59.75 45.45,59.2 v44.3,59.2 | v39.5,51.45 v39.51,51.45 40.17,50.78 40.17,50.22 39.9,49.95 39.9,49.38 36.23,45.7 36.23,45.14 35.36,44.27 26.52,44.27 21,38.75 21,34.93 19.77,33.7 19.77,26.52 19.4,26.15 R42.1
  Top 0.61: Q11.3 17.3,26.15 R42.1
  Bottom 0.2: v39.5,51.45 44.55,56.5 44.55,58.95 v44.3,59.2
LOCONET
  Top 0.406: R10.1 8.1,24.92 JP3.2
  Top 0.61: R10.1 8.2,27.35 Q2.2
LRESET
  Top 0.2: J5.7 77.17,17.48 R16.1
MISO  (via drill 0.35)
  Top 0.2: U5.22 51.25,71.5 49,73.75 49,79.5 49.5,80 51.31,80 SV1.1 | U7.MISO 85.59,50.66 v85.25,51 | v80,58.5 79.82,58.5 79.5,58.82 v79.5,77.75
  Bottom 0.2: v79.5,77.75 78.73,78.52 SV1.1 | v80,58.5 84.5,58.5 84.6,58.4 84.87,58.4 86.08,57.2 86.08,51.83 v85.25,51
MOSI  (via drill 0.35)
  Top 0.2: U5.21 51.75,67.57 51.65,67.67 51.65,71.67 50.25,73.07 SV1.4 | v78.75,77 78.75,58.8 79.97,57.58 80.67,57.58 v80.75,57.5 | U7.MOSI 104.25,13.99 104.25,32.25 102.5,34 102.5,50.5 100.75,52.25 v84.5,52.25
  Bottom 0.2: SV1.4 51.52,77.25 54.05,77.25 54.72,77.92 77.83,77.92 v78.75,77 | v84.5,52.25 85.67,53.42 85.67,57.03 84.7,58 81,58 80.75,57.75 v80.75,57.5
N$1
  Top 0.254: LED5.K 73.77,114 66.9,114
  Top 0.406: 66.9,114 R6.2
N$2
  Top 0.254: U5.98 65.5,63.75 66,64.25 C25.2
N$3
  Top 0.406: R35.2 61.27,112.62 61.27,113.27 62.75,114.75 LED4.K
N$4
  Top 0.2: R15.2 73,27.25 73.39,27.64 IC2.16
N$5
  Top 0.406: 8.25,35.55 8.25,32 7.6,31.35 Q2.3 | 8.25,35.55 Q3.1 | 8.25,35.55 8.25,36.75 2.5,36.75 1.65,35.9 R11.1
N$6
  Top 0.61: Q1.1 3.15,28 R3.1
N$7
  Top 0.61: D7.A 49.9,34.88 JP1.2 50.52,37.83 R28.2 Q7.3
N$8  (via drill 0.35)
  Top 0.406: R10.2 6.3,27.35 Q2.1 6,29.45 v6,32 | Q3.2 6.15,35.75 v5,35.75
  Bottom 0.406: v5,35.75 5,33 v6,32
N$9
  Top 0.2: R13.1 R37.1 71.15,21.15 71.75,21.75 71.75,27 72.75,28 72.75,32.5 73,32.75 74,32.75 74.66,32.09 IC2.17
N$10
  Top 0.2: IC2.14 70.84,32.34 71.75,33.25 74.5,33.25 75.28,32.47 75.28,20.14 R17.2
N$11
  Top 0.2: IC2.12 68.31,32.8 69.25,33.75 75,33.75 76.56,32.2 76.56,29.58 76.5,29.52 76.5,19.85 R16.2
N$12
  Top 0.2: 55.8,37.5 54.9,37.5 54.4,38 54.4,38.87 54.22,39.05 53.35,39.05 R1.1
  Top 0.61: 55.8,37.5 Q7.1
N$13  (via drill 0.35)
  Top 0.2: IC2.9 68.31,37.45 v68.5,37.25 | R14.2 77.75,20.35 77.75,29.5 77.83,29.58 77.83,31.86 77.75,31.94 v77.75,36.75
  Bottom 0.2: v68.5,37.25 77.25,37.25 v77.75,36.75
N$14
  Top 0.254: Q5.1 24.8,32.15 R25.1
N$15
  Top 0.254: R24.1 31.55,34.6 Q4.1
N$16
  Top 0.254: R23.2 27,32.35 Q5.2 Q4.3
N$17
  Top 0.254: D2.A 27,16.48 J1.5
N$18
  Top 0.254: R23.1 D2.C
  Top 0.406: R23.1 R22.1
N$19
  Top 0.2: Q5.3 26,26.35 R22.2
  Top 0.254: J1.1 21.82,25.07 22.1,25.35 R22.2
N$20
  Top 0.254: R5.2 28.8,21.4 Q6.1
N$21
  Top 0.254: R5.1 28.75,12.93 J1.6
N$22
  Top 0.406: Q9.1 24.98,105.9 D5.1 26.55,104.6 R31.1
N$23
  Top 2.54: Q9.3 11.31,108 U$2.TIP
N$24
  Top 0.2: U5.33 43,61.25 41.75,62.5 41.75,66.92 41.67,67
  Top 0.305: C14.2 41.67,67 Y1.2
N$25  (via drill 0.35)
  Top 0.406: IC1.1 87.29,112.63 C13.1
  Top 0.813: IC1.1 84.87,112.63 v84.75,112.75
  Top 1.27: v70,112.5 C12.2
  Top 2.54: K1.P 46.5,94.75 47.25,95.5 54.25,95.5 55.68,96.93 v55.68,110.25
  Bottom 2.54: v84.75,112.75 74.25,112.75 74,112.5 v70,112.5 57.5,112.5 55.68,110.68 v55.68,110.25
N$26  (via drill 0.35, 0.6)
  Top 0.61: C16.1 87.25,104.98 IC1.7
  Top 0.813: IC1.7 v85.01,105.01
  Top 1.27: v70,104.76 C12.1
  Bottom 2.54: v85.01,105.01 84.76,104.76 v70,104.76 55.24,104.76 v52.25,107.75 46.31,113.69 43.27,113.69 41.8,115.17 X9.1 41.5,115.22 41.5,118.5 40.25,119.75 32.75,119.75 31.29,118.29 X9.3
N$27
  Top 0.813: Z3.C 65.36,20.85 F2.1
  Bottom 1.27: F2.1 67.5,18.71 67.5,13.75 69.4,11.85 J5.1
N$28
  Top 0.2: U5.34 43,60.75 41.75,59.5 Y1.1
  Top 0.305: C15.2 38.18,57.42 Y1.1
N$29
  Top 0.254: R7.2 51.5,113.02 LED1.K
N$30
  Top 0.2: 97.73,76.73 97.75,76.73 | 97.75,76.73 U$1.C1 | 97.75,76.73 96.74,75.72 92.93,75.72 R32.2
N$31
  Top 0.2: U$1.C2 94.32,78.9 R29.2
N$32
  Bottom 2.54: X9.2 46.75,104.79 46.75,104 48.5,102.25 52.42,102.25 K1.S
N$33
  Top 0.254: JP2.2 R8.2
N$34
  Bottom 2.54: X9.6 16.05,104.45 18.25,102.25 26.25,102.25 28.5,100 28.5,96 30.04,94.46 B1.AC2
N$35
  Top 0.2: R38.2 87.75,75 | 87.75,75 R33.1 | 87.75,75 87.95,75.2 97.85,75.2 U$1.D1
N$36
  Top 0.406: U6.3 113.7,9.7 113,9 J6.D+
N$37
  Bottom 2.54: X9.4 26.21,115.15 27.09,114.26 27.09,113.66 32.75,108 37.5,108 40.53,104.97 K1.O
N$38
  Top 0.406: J6.D- 112.25,7.55 112.25,9.83 111.8,10.28 U6.1
N$39
  Top 0.61: 40.53,83.53 K1.2 | D4.A 40.75,83.75 40.53,83.53 | Q10.3 40,83 40.53,83.53
N$40
  Bottom 2.54: B1.AC1 24.54,109 24.25,109 21.13,112.12 X9.5
N$41
  Top 0.406: R50.2 LED7.K
N$42
  Top 0.2: Q10.1 40.24,81.59 40.63,81.59 41.03,82 48.25,82 49.65,83.4 R45.1
N$43
  Top 0.61: J7.4 8.37,13.62 J7.3 8.27,14.99 8.25,15.26 JP3.1 | JP3.1 8.27,22.25 R41.2 | JP3.1 5.87,22.23 R2.1 5.85,24.75 Q1.3
N$44
  Top 0.61: R41.1 14.65,22.25 Q11.1
N$45  (via drill 0.35)
  Top 0.254: IC5.15 107.53,25.73 109,24.25 v109,19
  Top 0.406: U6.4 113.7,17.55 v113.5,17.75
  Bottom 0.254: v109,19 109,17.75 v113.5,17.75
N$46
  Top 0.305: LED2.K 120.15,18.75 R46.2
N$47
  Top 0.406: R47.2 120.1,12.5 LED3.K
N$48
  Top 0.406: IC5.16 108.17,26.12 109.94,24.36 109.94,17.31 111.8,15.45 U6.6
N$49
  Top 0.406: 111.4,9.35 J6.VBUS
  Top 0.813: L1.2 110.25,10.5 111.4,9.35
N$50
  Top 0.406: LED6.K 19.15,80.12 R51.2
N$52  (via drill 0.35)
  Top 0.406: IC5.4 114.03,37.02 v114.5,37.5 | v112.25,39.25 SJ2.2
  Bottom 0.406: v114.5,37.5 112.75,39.25 v112.25,39.25
N$53  (via drill 0.35)
  Top 0.406: SJ2.1 109.23,37.73 v109,37.5 | v109,29.75 108.83,29.57 IC5.17
  Bottom 0.406: v109,37.5 v109,29.75
N$55  (via drill 0.35)
  Top 0.2: v91,59.25 90.84,59.41 IC3.1 | v91,38.25 91.09,38.16 U1.4
  Bottom 0.2: v91,59.25 v91,38.25
N$56  (via drill 0.35)
  Top 0.2: R52.2 28,39.15 v28,39.25 | IC3.3 88.78,56.75 v85,56.75
  Top 0.406: R52.2 R53.1
  Bottom 0.2: v28,39.25 80.75,39.25 81.75,40.25 81.75,53.5 v85,56.75
PROG  (via drill 0.35)
  Top 0.2: U5.92 v66.25,60.75 | v66,81.5 66.25,81.25 v66.25,70.75 | v53.5,82 52,83.5 R45.2
  Bottom 0.2: v53.5,82 65.5,82 v66,81.5 | v66.25,70.75 66.25,61 66,60.75 v66.25,60.75
PS/LOAD
  Top 0.2: J5.6 75.91,15.1 74.75,16.25 R17.1
RAIL_ON/OFF
  Top 0.2: U5.6 59.25,70.65 R54.1 58.65,71.75 58.65,73.22 58.83,73.4 58.83,74.06 60,75.23 60,113.75 61.5,115.25 61.5,117 59.62,118.89 52.6,118.89 S2.2
RAILDATA
  Top 0.2: J5.8 78.44,17.84 R14.1
RESET  (via drill 0.35)
  Top 0.2: U5.30 46.93,62.75 46.7,62.98 46.7,63.05 46.25,63.5 46.25,69.73 46.58,70.06 46.58,70.94 46.25,71.27 46.25,77.06 SV1.5 | v110.5,49.5 R9.1 | C18.2 v118,49.5 113.65,53.85 85.65,53.85 v85,54.5 80.25,59.25 80.25,75.73 79.92,76.06 79.92,76.94 80.25,77.27 v80.25,80.25 | v83.5,51.25 83.5,29.75 83.2,29.45 83.2,28.89 83.22,28.86 83.22,27.64 83.08,27.49 83.08,26.55 83.02,26.5 SJ1.1
  Bottom 0.2: v118,49.5 v110.5,49.5 | SV1.5 47.75,78.56 47.75,79.75 48.25,80.25 v80.25,80.25 | v83.5,51.25 83.5,53 v85,54.5
RXD  (via drill 0.35)
  Top 0.2: U5.2 61.3,66.8 61.3,67.62 62.02,68.35 64.44,68.35 65.1,69.01 76.44,69.01 77.95,67.5 77.95,58.46 83.36,53.05 109.07,53.05 112.92,49.2 J4.3
  Top 0.406: IC5.1 115.97,35.98 v116.5,36.5
  Bottom 0.406: J4.3 112.92,40.08 114.72,38.28 114.82,38.28 115.28,37.82 115.28,37.72 v116.5,36.5
RXD3  (via drill 0.35)
  Top 0.2: U5.63 v55.75,46.75 | JP5.1 32.77,47.23 33.25,46.75 v33.75,46.75
  Bottom 0.2: v33.75,46.75 35.25,46.75 35.5,47 52.79,47 53.04,46.75 v55.75,46.75
RXDLED
  Top 0.305: 112.25,29.75 120,29.75 120.25,29.5 R46.1
  Top 0.406: 112.25,29.75 112.08,29.57 IC5.22
S2  (via drill 0.35)
  Top 0.2: U5.17 53.7,66.8 53.7,67.62 53,68.32 R36.1 54.06,71.97 54.06,79.04 54.25,79.23 v54.25,91 | S3.2 65.74,118.21 65.87,118.08 65.87,116.93 62.5,113.56 v62.5,91.75
  Bottom 0.2: v62.5,91.75 54.75,91.75 54.25,91.25 v54.25,91
SCK  (via drill 0.35)
  Top 0.2: U5.20 52.2,66.8 52.2,67.69 52.05,67.84 52.05,71.83 51.5,72.38 51.5,77.25 50.25,78.5 SV1.3 | U7.SCLK 104.75,16.03 104.75,31.5 105.5,32.25 116.25,32.25 120.75,36.75 120.75,48.75 115.25,54.25 86.25,54.25 81,59.5 81,75.55 80.33,76.22 80.33,76.78 81,77.45 v81,79
  Bottom 0.2: SV1.3 51.49,79.76 71.54,79.76 71.55,79.75 77,79.75 77.75,79 v81,79
SCL  (via drill 0.35)
  Top 0.2: U5.43 46.51,56.25 43.26,53 36,53 v35.5,53.5 | R40.1 28.5,53.1 28.5,51.25 29.58,50.17 JP5.2
  Bottom 0.2: v35.5,53.5 33.5,51.5 31.5,51.5 30.23,50.23 JP5.2
SCLOCK
  Top 0.2: U5.96 63.8,62.7 72,62.7 74.66,60.04 IC2.4
SDA
  Top 0.2: U5.44 46.58,55.75 43.3,52.48 41.39,52.48 41.16,52.25 35.5,52.25 33.75,54 31.48,54 JP5.6 28.1,55.25 R44.1
SDATA
  Top 0.2: U5.97 63.8,63.2 72.06,63.2 75.92,59.34 IC2.3
SHORT  (via drill 0.35)
  Top 0.2: R26.1 61,69.5 59.75,68.25 U5.5 59.75,64.75 58,63 54.77,63 54.7,62.92 53.8,62.92 53.73,63 v50.75,63 | Q6.3 30.9,28.5 35,28.5 36.08,29.57 36.08,36.42 36.38,36.72 36.38,38.28 36.15,38.51 36.15,43.93 37.02,44.81 37.02,45.37 40.7,49.05 40.7,49.61 41.62,50.54 41.62,51.62 v41.75,51.75
  Bottom 0.2: v50.75,63 51.5,62.25 51.5,56 48,52.5 42.5,52.5 v41.75,51.75
SHORT2  (via drill 0.35)
  Top 0.2: v69.75,72.25 69.75,73 69.25,73.5 69.25,85.5 70.25,86.5 76.13,86.5 83.55,93.92 83.55,93.95 R18.2 | v49.5,45 49.75,45.25 U5.51
  Top 0.406: IC1.2 84.36,111.36 83.75,110.75 v83.5,110.75 | v86.5,95.25 84.85,95.25 R18.2
  Bottom 0.2: v69.75,72.25 69.75,48.25 67.58,46.08 56.64,46.08 56.24,45.67 50.86,45.67 50.18,45 v49.5,45
  Bottom 0.406: v83.5,110.75 84.65,110.75 84.68,110.78 86.47,110.78 88.5,108.75 88.5,97 86.75,95.25 v86.5,95.25
SPS/LOAD
  Top 0.2: IC2.6 72.11,52.16 73.8,53.84 73.8,60.33 71.91,62.23 63.77,62.23 U5.95
SRESET
  Top 0.2: U5.94 65.73,61.75 65.81,61.83 71.74,61.83 73.4,60.17 73.4,54.08 71.49,52.17 71.47,52.17 69.58,50.28 IC2.8
SSHORT  (via drill 0.35)
  Top 0.2: U5.39 v46,58.25 | v45.75,80.25 45.5,80 45.5,71.45 46.17,70.78 46.17,70.22 45.5,69.55 v45.5,69.25 | LED4.A 58.67,115.94 58.67,102.22 58.58,102.12 58.58,81.33 v58.25,81
  Bottom 0.2: v46,58.25 46.5,58.75 46.5,68 45.5,69 v45.5,69.25 | v45.75,80.25 45.75,80.5 46.1,80.85 55.55,80.85 55.7,81 v58.25,81
TEMP
  Top 0.2: R49.2 69.25,59.54 | R48.2 69.25,59.54 | U5.86 66.5,57.75 67,58.25 67,59 67.54,59.54 69.25,59.54
TXD
  Top 0.2: U5.3 60.75,68.25 61.25,68.75 64.28,68.75 64.93,69.41 76.61,69.41 78.35,67.66 78.35,58.63 83.53,53.45 109.98,53.45 115.46,47.97 J4.2
  Top 0.406: IC5.5 113.38,38.62 115.46,40.71 J4.2
TXD3  (via drill 0.35)
  Top 0.2: U5.64 56.25,47.25 v56.75,46.75 | JP5.3 34.75,50.73 v34.75,45.75
  Bottom 0.2: v56.75,46.75 56.08,46.08 55.47,46.08 55.31,46.23 52.71,46.23 52.44,46.5 35.57,46.5 35.42,46.35 35.35,46.35 v34.75,45.75
TXDLED
  Top 0.305: IC5.23 112.72,26.77 113.05,26.45 113.65,26.45 113.85,26.25 117.08,26.25 117.08,18.26 117.25,18.09 117.25,16.5 118,15.75 119.5,15.75 120.25,15 R47.1
VBUS  (via drill 0.35)
  Top 0.406: U1.8 94.91,24.84 v95,24.75 | U1.7 93.64,24.86 93.75,24.75 | U1.6 92.36,24.89 92.5,24.75 | U1.5 91.09,24.91 91.25,24.75 | U6.5 v112.75,15.25
  Top 0.813: v108.25,15.25 L1.1
  Top 1.016: v95,24.75 93.75,24.75 92.5,24.75 91.25,24.75 | v107.75,21.75 107.75,15.75 v108.25,15.25
  Bottom 0.406: v112.75,15.25 v108.25,15.25
  Bottom 1.016: v95,24.75 104.75,24.75 v107.75,21.75
VCCIO  (via drill 0.35)
  Top 0.406: Q3.3 6.65,34 C7.1
  Top 0.61: R28.1 47.98,37.83 JP1.1 48,35.48 D7.C | R11.2 C7.1 3.35,32.4 v3.75,32
  Top 1.27: 12.18,11.07 13.5,9.75 32.75,9.75 | 12.18,11.07 12.05,11.2 12.18,11.32 J7.6 | 32.75,9.75 45.25,9.75 47.5,12 | 47.5,12 49.75,9.75 61.5,9.75 62.75,11 v62.75,12.5 | Z4.C 32.75,9.75 | D7.C 48,15.75 47.14,14.89 | 47.14,14.89 J3.5 | J7.1 4.75,13.81 4.75,11.25 6.25,9.75 10.85,9.75 12.18,11.07 | 47.14,14.89 47.5,14.53 47.5,12
  Bottom 0.406: v3.75,32 4.9,32 5.68,31.22 6.75,31.22 8.81,33.28 10.32,33.28 10.35,33.25 12.25,33.25 13.75,31.75 F1.1
  Bottom 1.27: v62.75,12.5 62.75,14.14 62.61,14.39 62.33,14.89 J2.5 | F1.1 13.75,15.43 J7.6
WRXD  (via drill 0.35)
  Top 0.2: R39.2 R38.1 87.4,76.5 v81,76.5 | U5.13 55.75,68.18 55.6,68.33 55.6,74.67 56.42,75.5 v56.75,75.5
  Bottom 0.2: v81,76.5 80.75,76.5 79.75,75.5 70.25,75.5 69.92,75.17 69.72,75.17 68.55,74 57.75,74 57,74.75 57,75.25 v56.75,75.5
WTXD  (via drill 0.35)
  Top 0.2: U$1.A2 71.94,81.94 70.5,80.5 70.5,75 v70,74.5 | U5.12 56.25,68.25 56,68.5 56,73.75 v56.5,74.25
  Bottom 0.2: v56.5,74.25 57.15,73.6 69.1,73.6 v70,74.5
XNET_RX  (via drill 0.35)
  Top 0.2: U5.45 46.7,55.25 42.02,50.57 42.02,50.37 41.1,49.45 41.1,48.88 37.42,45.21 37.42,44.64 36.55,43.77 36.55,38.92 36.77,38.7 36.77,36.05 36.75,36.03 36.75,31 v37,30.75 | IC6.1 42.41,30.09 v42.25,30.25
  Bottom 0.2: v37,30.75 42,30.75 42.25,30.5 v42.25,30.25
XNET_S/R  (via drill 0.35)
  Top 0.2: v46.75,50.5 40,43.75 40,29.25 | U5.18 53.25,65 v53.5,64.75
  Top 0.254: IC6.3 39.87,29.11 40,29.25 41,29.25 41.13,29.11 IC6.2
  Bottom 0.2: v53.5,64.75 53.5,52.92 52,51.42 47.67,51.42 v46.75,50.5
XNET_TX
  Top 0.2: U5.46 46.77,54.75 42.42,50.41 42.42,50.21 41.5,49.28 41.5,48.72 38.59,45.81 IC6.4
XPA
  Top 0.254: J2.4 57.63,22.11 57,22.75 57.25,23 JP2.1 | J3.4 40.36,13.62 39.84,13.62 39.1,14.37 39.1,15.41 39.87,16.18 IC6.6
  Top 0.406: Z2.C 57.52,25.12 JP2.1 59.15,23 R12.1
  Bottom 0.254: J2.4 57.63,12.63 55.75,10.75 43,10.75 41.63,12.12 41.63,12.25 | J3.4 41.63,12.25 | J1.4 27.48,10.5 39.88,10.5 41.63,12.25
XPB
  Top 0.254: R34.2 51,23.1 R8.1 51.5,22.4 51.5,20.25 52.25,19.5 55.25,19.5 56.37,18.39 J2.3 | IC6.7 41.13,17.25 40.37,16.48 J3.3
  Top 0.406: R34.2 53.3,25.15 Z1.C
  Bottom 0.254: J2.3 56.37,17.14 55.5,18 41.98,18 40.37,16.39 40.37,16.11 | J1.3 24.36,16.11 25.25,17 39.75,17 40.5,16.25 40.37,16.11 | 40.37,16.11 J3.3

## Text on the board
Dimension: Designed for Hammond 1598B Enclosure
tPlace: STOP/GO | +12V | GND | +5V | RXD | GND | TXO | Arduino Z21 DCC Zentrale / IoT Tech & / Philipp Gahtow / July 2019 | RXI | 5V | D12 | RESET | S88 | RX | LNBus | Booster | XNET | XNET | TX